# Altium schematic sheet Main.SchDoc
size Letter; Revision: 1; SheetNumber: 1; SheetTotal: 4
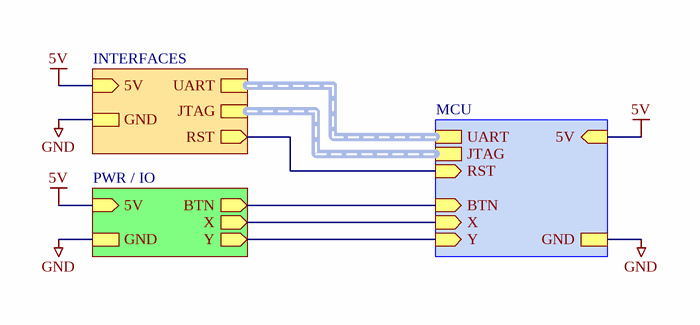
[diagram p0: Main.SchDoc]

## Sub-sheets
INTERFACES = INTERFACE.SchDoc: GND, 5V (in), UART (harness MCU_UART), RST (out), JTAG (harness MCU_SPI)
MCU = MCU.SchDoc: GND, 5V (in), X (in), BTN (in), Y (in), UART (harness MCU_UART), JTAG (harness MCU_SPI), RST (in)
PWR / IO = INPUT.SchDoc: GND, 5V (in), X (out), BTN (out), Y (out)

## Nets
5V: sheet MCU/5V, sheet PWR / IO/5V, sheet INTERFACES/5V
GND: sheet MCU/GND, sheet PWR / IO/GND, sheet INTERFACES/GND
(unnamed): sheet MCU/X, sheet PWR / IO/X
(unnamed): sheet MCU/BTN, sheet PWR / IO/BTN
(unnamed): sheet MCU/Y, sheet PWR / IO/Y
(unnamed): sheet MCU/RST, sheet INTERFACES/RST

## Buses and harness runs
harness sheet INTERFACES/JTAG = sheet MCU/JTAG
harness sheet INTERFACES/UART = sheet MCU/UART

## Notes on the sheet
- SHEET
- REVISION
- OF
- PROJECT
- REVIEWER
- ENGINEER
- DATE